# EAGLE design nano relay (EAGLE 9.6.2)
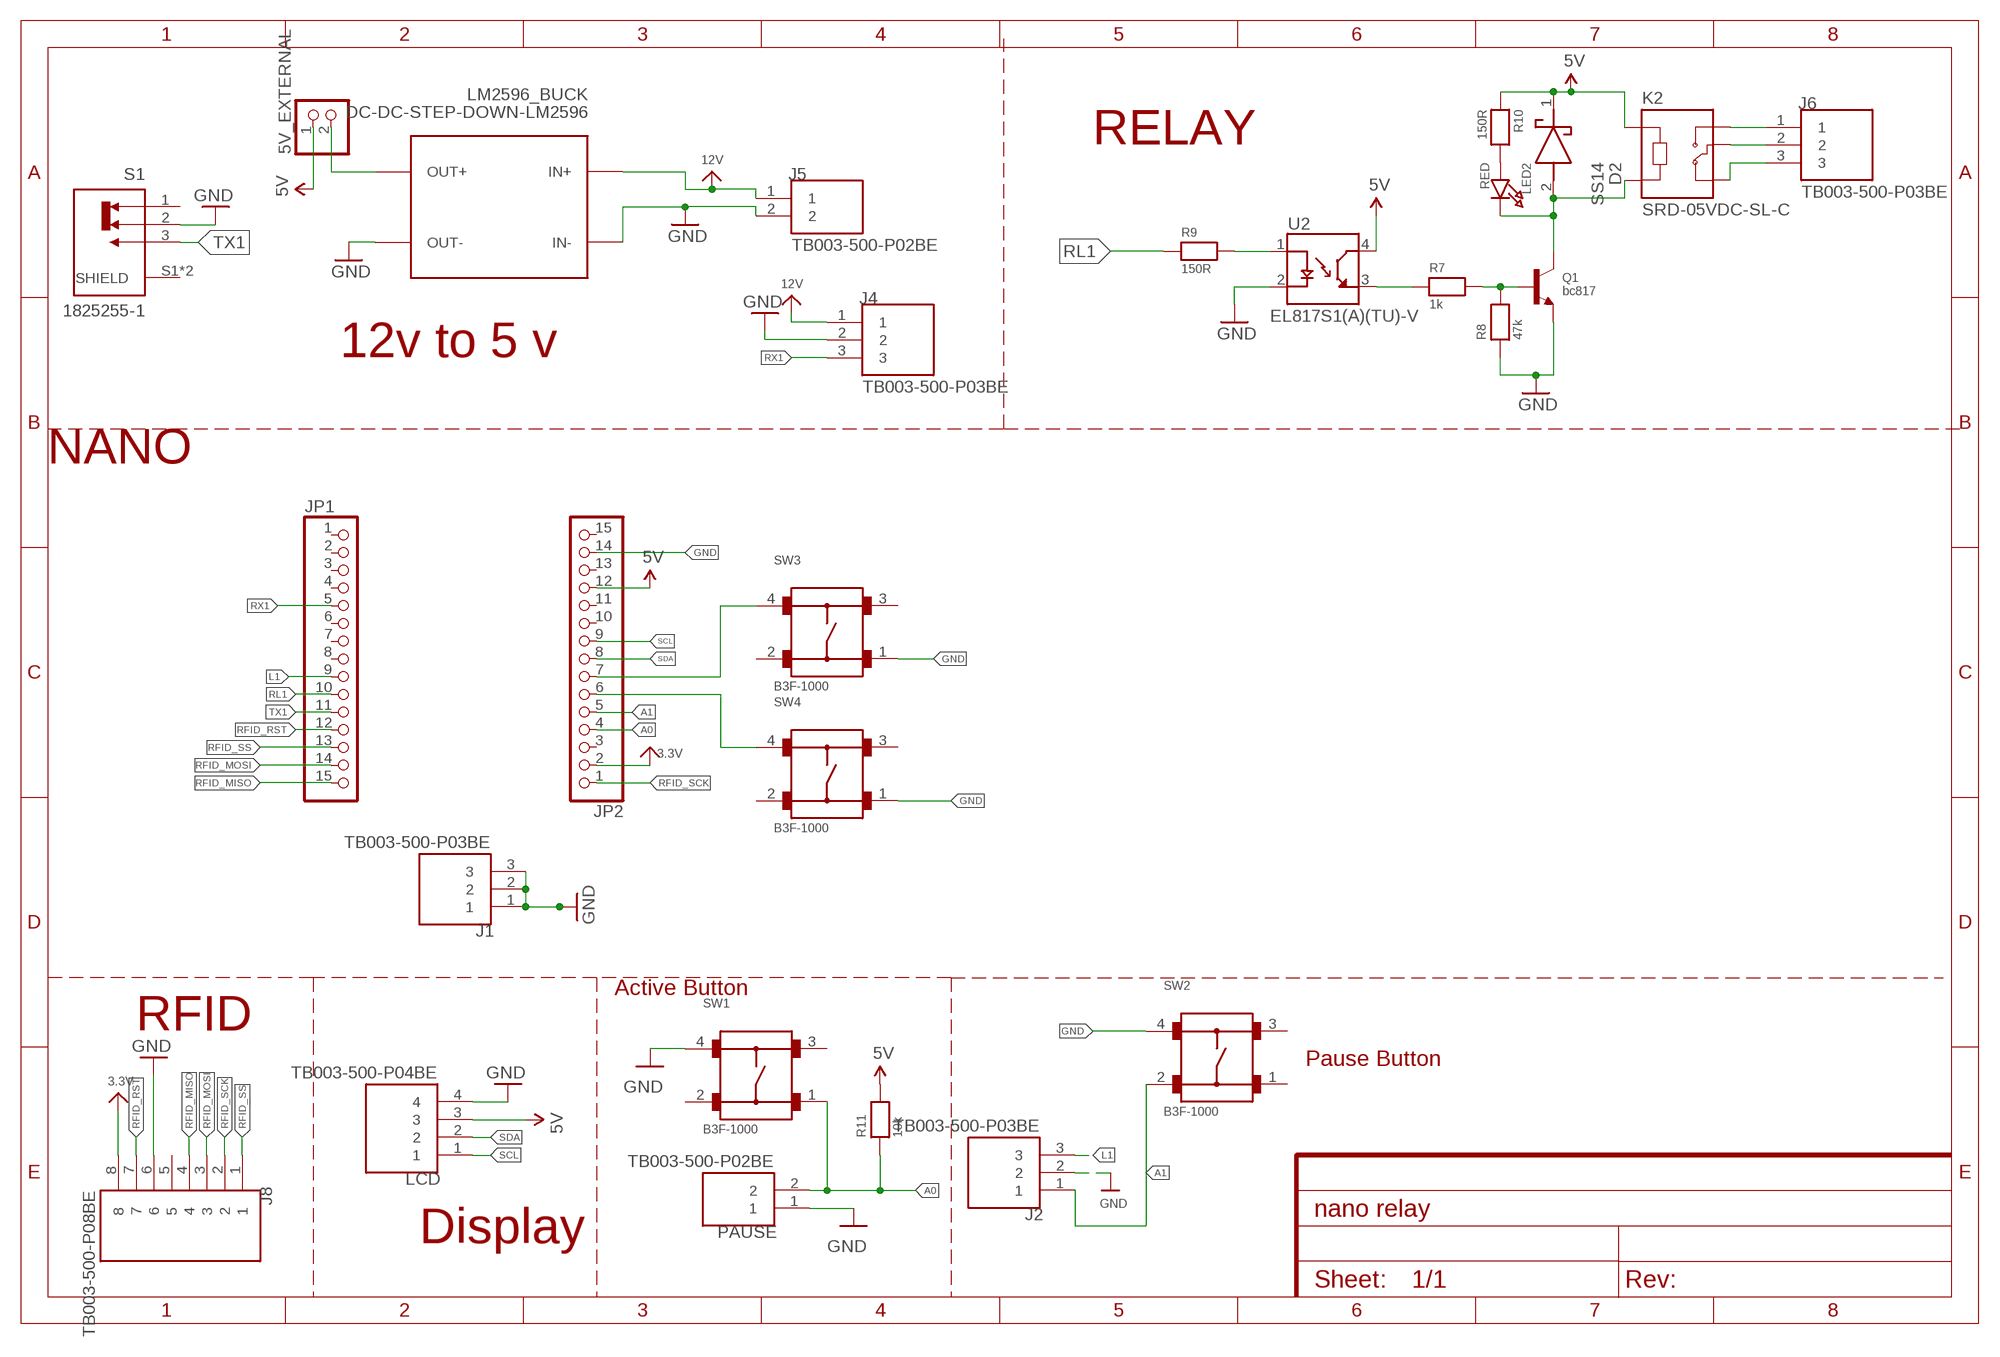
[diagram p0: schematic, sheet 1]

## Parts
5V_EXTERNAL  HEADER-1X2ROUND  [1X02_ROUND]
D2  SS14  [DIOM5227X270N]
J1  TB003-500-P03BE  [CUI_TB003-500-P03BE]
J2  TB003-500-P03BE  [CUI_TB003-500-P03BE]
J4  TB003-500-P03BE  [CUI_TB003-500-P03BE]
J5  TB003-500-P02BE  [CUI_TB003-500-P02BE]
J6  TB003-500-P03BE  [CUI_TB003-500-P03BE]
J8  TB003-500-P08BE  [CUI_TB003-500-P08BE]
JP1  HEADER-1X15  [1X15_ROUND_70]
JP2  HEADER-1X15  [1X15_ROUND_70]
K2  SRD-05VDC-SL-C  [RELAY_SRD-05VDC-SL-C]
LCD  TB003-500-P04BE  [CUI_TB003-500-P04BE]
LED2  RED  LED0603  [CHIPLED_0603]
LM2596_BUCK  DC-DC-STEP-DOWN-LM2596  [DC-DC-STEP-DOWN-LM2596]
PAUSE  TB003-500-P02BE  [CUI_TB003-500-P02BE]
Q1  bc817  TRANSISTOR_NPN  [SOT23-R]
R7  1k  RESISTOR0603  [0603]
R8  47k  RESISTOR0603  [0603]
R9  150R  RESISTOR0603  [0603]
R10  150R  RESISTOR0402  [0402]
R11  10k  RESISTOR0603  [0603]
S1  1825255-1  [SW_1825255-1]
SW1  B3F-1000  [B3F-1000]
SW2  B3F-1000  [B3F-1000]
SW3  B3F-1000  [B3F-1000]
SW4  B3F-1000  [B3F-1000]
U2  EL817S1(A)(TU)-V  [SOIC254P1030X390-4N_EL817S1(A)(TU)-V]

## Nets
3.3V: J8.8 JP2.2
5V: 5V_EXTERNAL.1 D2.1(K) JP2.12 K2.A1 LCD.3 R10.1 R11.2 U2.4(CT)
12V: J4.1 J5.1 LM2596_BUCK.IN+
A0: JP2.4 PAUSE.2 R11.1 SW1.1
A1: J2.1 JP2.5 SW2.2
GND: J1.1 J1.2 J1.3 J2.2 J4.2 J5.2 J8.6 JP2.14 LCD.4 LM2596_BUCK.IN- LM2596_BUCK.OUT- PAUSE.1 Q1.2(E) R8.1 S1.2 SW1.4 SW2.4 SW3.1 SW4.1 U2.2(C)
L1: J2.3 JP1.9
N$1: JP2.7 SW3.4
N$2: J6.1 K2.NO
N$3: LED2.A R10.2
N$4: JP2.6 SW4.4
N$5: J6.2 K2.COM
N$11: D2.2(A) K2.A2 LED2.C Q1.3(C)
N$12: Q1.1(B) R7.2 R8.2
N$13: J6.3 K2.NC
N$14: R7.1 U2.3(ET)
N$15: 5V_EXTERNAL.2 LM2596_BUCK.OUT+
N$16: R9.2 U2.1(A)
RFID_MISO: J8.4 JP1.15
RFID_MOSI: J8.3 JP1.14
RFID_RST: J8.7 JP1.12
RFID_SCK: J8.2 JP2.1
RFID_SS: J8.1 JP1.13
RL1: JP1.10 R9.1
RX1: J4.3 JP1.5
SCL: JP2.9 LCD.1
SDA: JP2.8 LCD.2
TX1: JP1.11 S1.3
Unconnected: J8.5 JP1.1 JP1.2 JP1.3 JP1.4 JP1.6 JP1.7 JP1.8 JP2.3 JP2.10 JP2.11 JP2.13 JP2.15 S1.1 S1.S1(SHIELD) S1.S2(SHIELD) SW1.2 SW1.3 SW2.1 SW2.3 SW3.2 SW3.3 SW4.2 SW4.3

## Notes on the sheet
- RELAY
- 12v to 5 v
- NANO
- Active Button
- RFID
- Pause Button
- Display

## Library data of the parts
5V_EXTERNAL = microbuilder:HEADER-1X2: PIN HEADER
D2 = SS14:SS14: 1.0 A Schottky Barrier Rectifiers Source: Datasheet <http://www.onsemi.com/pub/Collateral/SS19-D.pdf>; DESCRIPTION: 1.0 A Schottky Barrier Rectifiers; HEIGHT: 2.7mm; MANUFACTURER_NAME: ON Semiconductor; MANUFACTURER_PART_NUMBER: SS14; MOUSER_PART_NUMBER: 512-SS14; MOUSER_PRICE-STOCK: https://www.mouser.com/Search/Refine.aspx?Keyword=512-SS14; RS_PART_NUMBER: 7390467P; RS_PRICE-STOCK: http://uk.rs-online.com/web/p/products/7390467P
J1 J2 J4 J6 = TB003-500-P03BE:TB003-500-P03BE: Check prices <https://pricing.snapeda.com/parts/TB003-500-P03BE/CUI%20Devices/view-part?ref=eda>; AVAILABILITY: Good; CUI_PURCHASE_URL: https://www.cuidevices.com/product/interconnect/connectors/terminal-blocks/tb003-500-series?utm_source=snapeda.com&utm_medium=referral&utm_campaign=snapedaBOM; DESCRIPTION: 2~24 Poles, Screw Type, Horizontal, 5.0 Pitch, 26~14 (AWG), Terminal Block Connector; MF: CUI Devices; MP: TB003-500-P03BE; PACKAGE: None; PRICE: None; PURCHASE-URL: https://pricing.snapeda.com/search/part/TB003-500-P03BE/?ref=eda
J5 PAUSE = TB003-500-P02BE:TB003-500-P02BE: Check prices <https://pricing.snapeda.com/parts/TB003-500-P02BE/CUI%20Devices/view-part?ref=eda>; AVAILABILITY: Good; CUI_PURCHASE_URL: https://www.cuidevices.com/product/interconnect/connectors/terminal-blocks/tb003-500-series?utm_source=snapeda.com&utm_medium=referral&utm_campaign=snapedaBOM; DESCRIPTION: 2~24 Poles, Screw Type, Horizontal, 5.0 Pitch, 26~14 (AWG), Terminal Block Connector; MF: CUI Devices; MP: TB003-500-P02BE; PACKAGE: None; PRICE: None; PURCHASE-URL: https://pricing.snapeda.com/search/part/TB003-500-P02BE/?ref=eda
J8 = TB003-500-P08BE:TB003-500-P08BE: Check prices <https://pricing.snapeda.com/parts/TB003-500-P08BE/CUI%20Devices/view-part?ref=eda>; AVAILABILITY: Good; CUI_PURCHASE_URL: https://www.cuidevices.com/product/interconnect/connectors/terminal-blocks/tb003-500-series?utm_source=snapeda.com&utm_medium=referral&utm_campaign=snapedaBOM; DESCRIPTION: 2~24 Poles, Screw Type, Horizontal, 5.0 Pitch, 26~14 (AWG), Terminal Block Connector; MF: CUI Devices; MP: TB003-500-P08BE; PACKAGE: None; PRICE: None; PURCHASE-URL: https://pricing.snapeda.com/search/part/TB003-500-P08BE/?ref=eda
JP1 JP2 = microbuilder:HEADER-1X15: 1x15 Header
K2 = SRD-05VDC-SL-C:SRD-05VDC-SL-C: 5V Trigger Relay Module For Arduino And Raspberry Pi 5V Trigger Relay Module For Arduino And Raspberry Pi; AVAILABILITY: Unavailable; DESCRIPTION: 5V Trigger Relay Module For Arduino And Raspberry Pi 5V Trigger Relay Module For Arduino And Raspberry Pi; MF: Songle Relay; MP: SRD-05VDC-SL-C; PACKAGE: None; PRICE: None
LCD = TB003-500-P04BE:TB003-500-P04BE: Check prices <https://pricing.snapeda.com/parts/TB003-500-P04BE/CUI%20Devices/view-part?ref=eda>; AVAILABILITY: Good; CUI_PURCHASE_URL: https://www.cuidevices.com/product/interconnect/connectors/terminal-blocks/tb003-500-series?utm_source=snapeda.com&utm_medium=referral&utm_campaign=snapedaBOM; DESCRIPTION: 2~24 Poles, Screw Type, Horizontal, 5.0 Pitch, 26~14 (AWG), Terminal Block Connector; MF: CUI Devices; MP: TB003-500-P04BE; PACKAGE: None; PRICE: None; PURCHASE-URL: https://pricing.snapeda.com/search/part/TB003-500-P04BE/?ref=eda
LED2 = microbuilder:LED: LED 0603 - 0603 Surface Mount Package 2mA: Green LED - Low Power (3.9mcd, 2ma, 1.7Vf) - Digikey: 475-2709-2-ND Orange LED - Low Power (9.8mcd, 2ma, 1.8Vf) - Digikey: 475-1194-2-ND Red LED - Low Power (5mcd, 2ma, 1.8Vf) - Digikey: 475-1195-2-ND Yellow LED - Low Power (7mcd, 2ma, 1.8Vf) - Digikey: 475-1196-2-ND 5mA: Blue LED - Low Power (17mcd, 5ma, 2.9Vf) - Digikey: LNJ937W8CRACT-ND 0805 - 0805 Surface Mount Package 2mA: Red LED (8.8mcd, 2mA, 1.8Vf, Clear) - Low Power [Digikey: 475-2510-1-ND] Green LED (5mcd, 2mA, 1.8Vf, Clear) - Low Power [Digikey: 475-2730-1-ND] Yellow LED (11.3mcd, 2mA, 1.8Vf, Clear) - Low Power [Digikey: 475-2555-1-ND] 20mA: Red LED (104mcd, 20mA, Diffused) - LS R976 [Digikey: 475-1278-6-ND] Red LED (12mcd, 20mA, 2.0Vf, Clear) - APT2012EC [Digikey: 754-1128-1-ND] Green LED (15mcd, 20mA, 2.2Vf, Clear) - APT2012GC [Digikey: 754-1131-1-ND] Orange LED (160mcd, 20mA, 2.1Vf, Clear) - APT2012SECK [Digikey: 754-1130-1-ND] 1206 - 1206 Surface Mount Package Green LED (26mcd, 20mA, Diffused) - LG N971 [Digikey: 475-1407-6-ND] Red LED (15mcd, 20mA, Diffused) - LH N974 [Digikey: 475-1416-6-ND]
LM2596_BUCK = diy-modules:DC-DC-STEP-DOWN-LM2596: DC/DC Step-Down Regulator based on LM2596-ADJ chip LM2596 datasheet available here: http://www.ti.com/lit/ds/symlink/lm2596.pdf Click here to find device on ebay.com <http://www.ebay.com/sch/lm2596+power+regulator>
Q1 = microbuilder:TRANSISTOR_NPN: NPN Transistor Transistor (NPN) 500mA 45V - BC817 [Digikey: 568-1631-1-ND] Transistor (NPN) 500mA 45V - BC817,215 [Mouser: 771-BC817-T/R] SOT23-R - SOT23 footprint optimised for use with solder paste and reflow ovens. SOT23-W - SOT23 footprint optimised for hand-soldering (larger pads).
R7-R11 = microbuilder:RESISTOR: Resistors 0402 - 0402 Surface Mount Package 22 Ohm 1% 1/16W [Digikey: 311-22.0LRTR-ND] 33 Ohm 5% 1/16W 1.0K 5% 1/16W 1.5K 5% 1/16W 2.0K 1% 1/16W 10.0K 1% 1/16W [Digikey: 311-10.0KLRTR-ND] 10.0K 5% 1/16W [Digikey: RMCF0402JT10K0TR-ND] 12.1K 1% 1/16W [Digikey: 311-22.0LRTR-ND] 100.0K 5% 1/16W 0603 - 0603 Surface Mount Package 0 Ohm 1/10 Watt 1% Resistor 15 Ohm 1/10 Watt 1% Resistor 33 Ohm 1/10 Watt 1% Resistor 49.9 Ohm 1/10 Watt 1% Resistor 100 Ohm 1/10 Watt 1% Resistor 150 Ohm 1/10 Watt 1% Resistor 240 Ohm 1/10 Watt 1% Resistor 390 Ohm 1/10 Watt 1% Resistor 560 Ohm 1/10 Watt 1% Resistor 680 Ohm 1/10 Watt 1% Resistor 750 Ohm 1/10 Watt 1% Resistor 1.0K Ohm 1/10 Watt 1% Resistor 1.5K Ohm 1/10 Watt 1% Resistor 2.0K Ohm 1/10 Watt 1% Resistor 2.2K Ohm 1/10 Watt 1% Resistor 3.3K Ohm 1/10 Watt 1% Resistor 4.7K Ohm 1/10 Watt 1% Resistor 10.0K Ohm 1/10 Watt 1% Resistor 12.0K Ohm 1/10 Watt 1% Resistor 12.1K Ohm 1/10 Watt 1% Resistor 20.0K Ohm 1/10 Watt 1% Resistor 33.0K Ohm 1/10 Watt 1% Resistor 100.0K Ohm 1/10 Watt 1% Resistor 0805 - 0805 Surface Mount Package 0 Ohm 1/8 Watt 1% Resistor 33 Ohm 1/8 Watt 1% Resistor 100 Ohm 1/8 Watt 1% Resistor 150 Ohm 1/8 Watt 1% Resistor 200 Ohm 1/8 Watt 1% Resistor 240 Ohm 1/8 Watt 1% Resistor 330 Ohm 1/8 Watt 1% Resistor 390 Ohm 1/8 Watt 1% Resistor 470 Ohm 1/8 Watt 1% Resistor 1.0K Ohm 1/8 Watt 1% Resistor 1.5K Ohm 1/8 Watt 1% Resistor 2.0K Ohm 1/8 Watt 1% Resistor 4.7K Ohm 1/8 Watt 1% Resistor 5.1K Ohm 1/8 Watt 1% Resistor 5.6K Ohm 1/8 Watt 1% Resistor 10.0K Ohm 1/8 Watt 1% Resistor 22.0K Ohm 1/8 Watt 1% Resistor 33.0K Ohm 1/8 Watt 1% Resistor 100K Ohm 1/8 Watt 1% Resistor 1206 - 1206 Surface Mount Package 2012 - 2010 Surface Mount Package 0.11 Ohm 1/2 Watt 1% Resistor - Digikey: RHM.11UCT-ND
S1 = 1825255-1:1825255-1: Switch Slide ON None ON SPDT Top Slide 0.3A 125VAC PC Pins Thru-Hole Tray; COMMENT: 1825255-1; DESCRIPTION: Switch Slide ON None ON SPDT Top Slide 0.3A 125VAC PC Pins Thru-Hole Tray; DIGI-KEY_PART_NUMBER: 450-1567-ND; MF: TE Connectivity; MP: 1825255-1; PACKAGE: Custom Package TE Connectivity; PURCHASE-URL: https://pricing.snapeda.com/search/part/1825255-1/?ref=eda
SW1-SW4 = Switch:B3F-1000: Tactile Switch SPST-NO Top Actuated Through Hole Manufacturer's datasheet <https://omronfs.omron.com/en_US/ecb/products/pdf/en-b3f.pdf>; CREATED_BY: PCBLayout.com; DIGI_KEY_PART_NUMBER: SW400-ND; MANUFACTURER: Omron Electronics Inc-EMC Div; MPN: B3F-1000; PACKAGE: SPST-NO
U2 = EL817S1_A__TU_-V:EL817S1(A)(TU)-V: Optoisoltr 5kv Transistor 4-Smd; DESCRIPTION: Optoisolator Transistor Output 5000Vrms 1 Channel 4-SMD; DIGI-KEY_PART_NUMBER: EL817S1(A)(TU)-V-ND; MF: Everlight Electronics; MP: EL817S1(A)(TU)-V; PACKAGE: SMD-4 Everlight Electronics Co Ltd

## Net classes
0 default: width 0.203 mm, drill 0.406 mm, clearance 0.203 mm

## Board
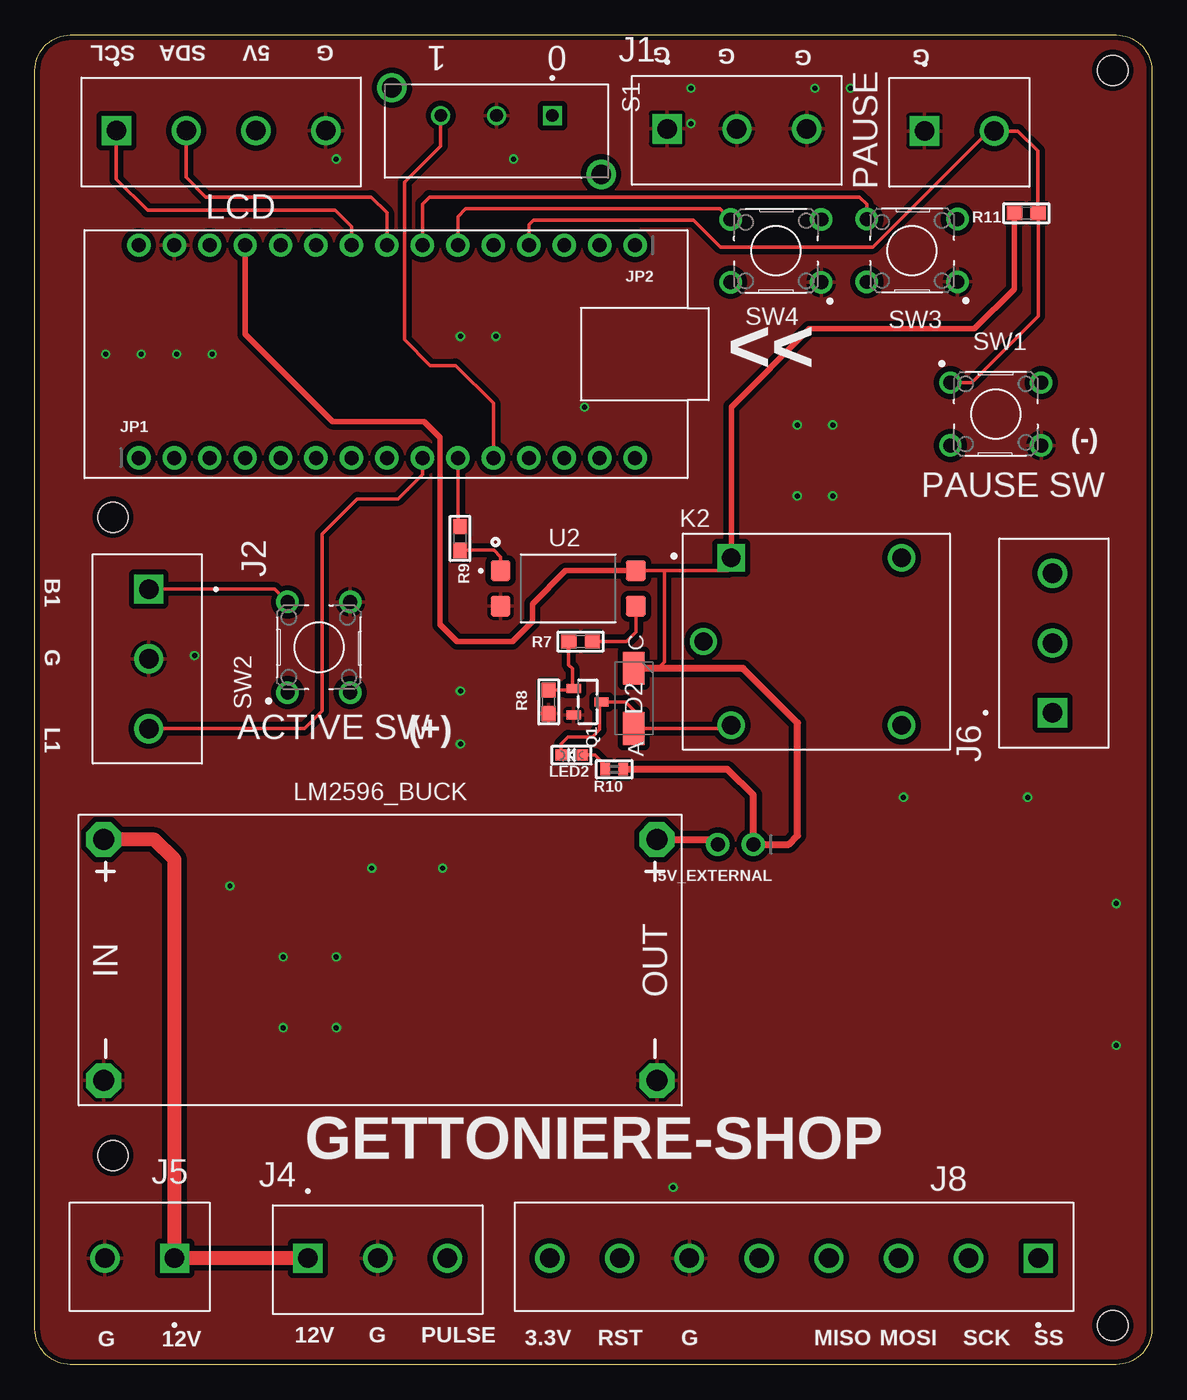
[diagram p1: board, top side]
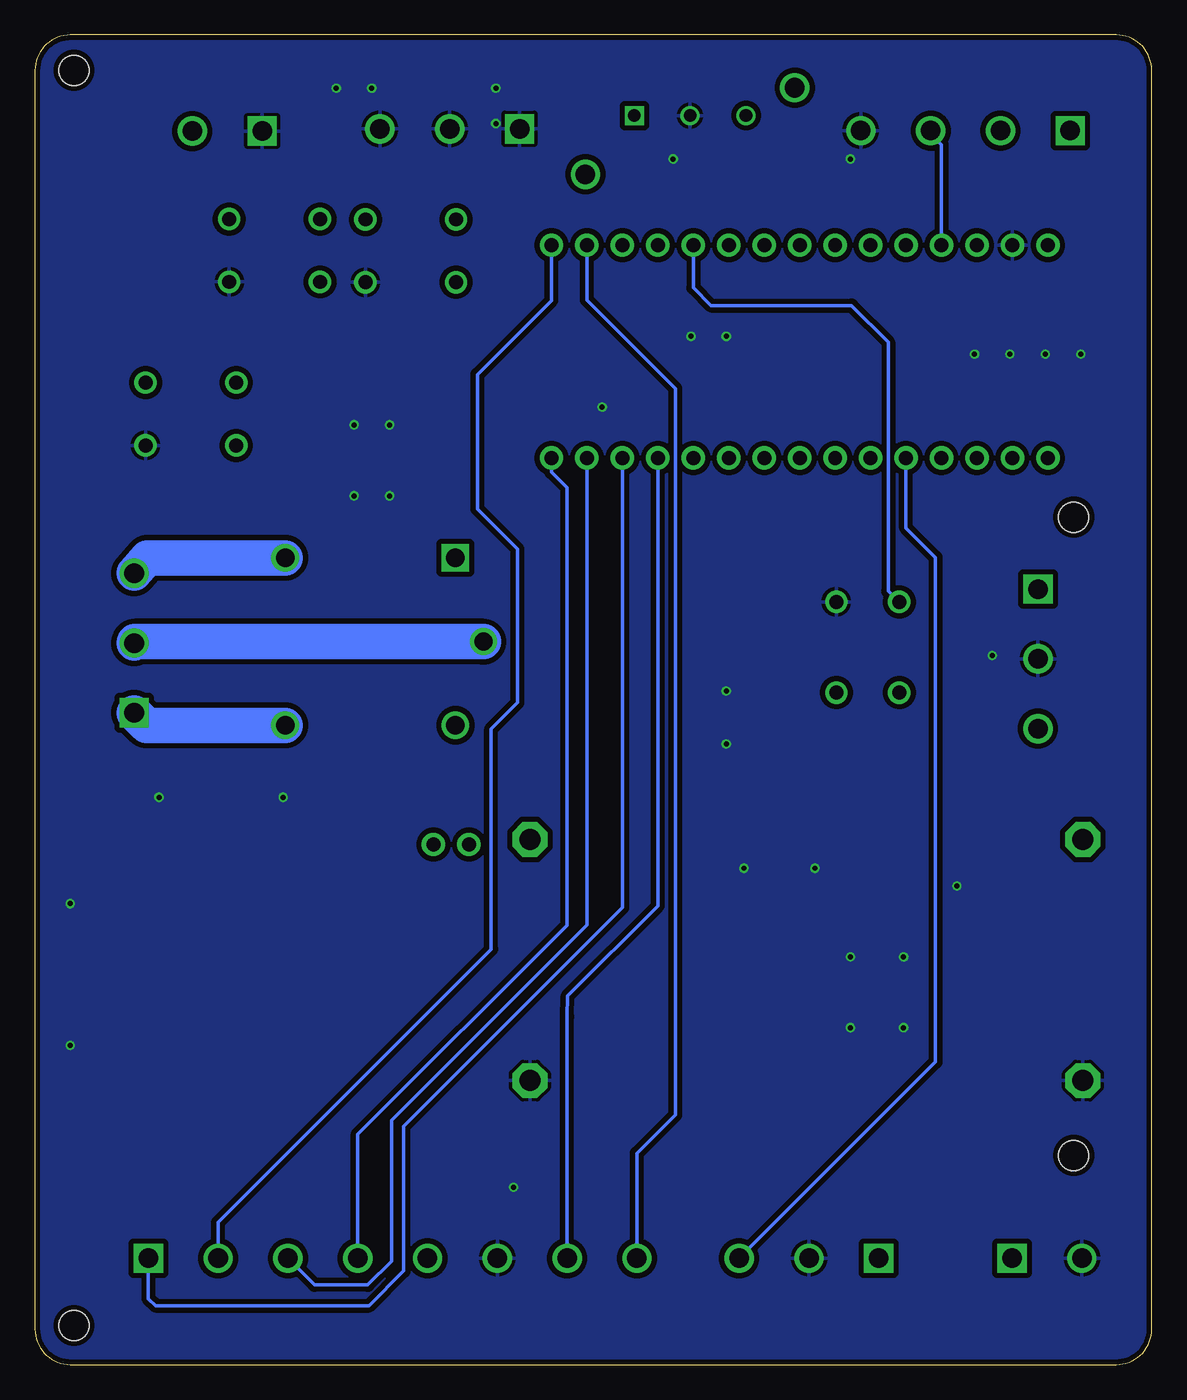
[diagram p2: board, bottom side, seen from below]

Size 80.01 x 95.25 mm. Coordinates in mm from the lower left corner, seen from the top.
Outline: 80.01,92.71 80.01,2.54 arc-90 77.47,0 2.54,0 arc-90 0,2.54 0,92.71 arc-90 2.54,95.25 77.47,95.25 arc-90 80.01,92.71
Copper layers (1*16): Top 0.035mm / dielectric 1.5mm / Bottom 0.035mm
Design rules "default *": minimum track width 8mil, minimum drill 0.3mm, track to track 6mil, track to pad 6mil, pad to pad 6mil, via to via 6mil, smd to smd 0mil, copper to edge 10mil, drill to drill 6mil, minimum pad ring 8mil, minimum via ring 6mil, stop-mask expansion 2mil, vias tented up to drill 15mil, thermal gap 10mil
Holes 2.16 mm at 77.22,2.79 77.22,92.71 5.59,14.99 5.59,60.71

### Footprints (pad centres in the part's own frame; a part is rotated, then mirrored left to right if it is on the bottom)
1X02_ROUND = drill 1 pad 1.676: 1 -1.27,0; 2 1.27,0
DIOM5227X270N = smd 2.35 x 1.55: 1 -2.15,0; 2 2.15,0
CUI_TB003-500-P03BE = drill 1.4 square: 1 0,0 | drill 1.4: 2 5,0; 3 10,0
CUI_TB003-500-P02BE = drill 1.4 square: 1 0,0 | drill 1.4: 2 5,0
CUI_TB003-500-P08BE = drill 1.4 square: 1 0,0 | drill 1.4: 2 5,0; 3 10,0; 4 15,0; 5 20,0; 6 25,0; 7 30,0; 8 35,0
1X15_ROUND_70 = drill 1 pad 1.676: 1 -17.78,0; 2 -15.24,0; 3 -12.7,0; 4 -10.16,0; 5 -7.62,0; 6 -5.08,0; 7 -2.54,0; 8 0,0; 9 2.54,0; 10 5.08,0; 11 7.62,0; 12 10.16,0; 13 12.7,0; 14 15.24,0; 15 17.78,0
RELAY_SRD-05VDC-SL-C = drill 1.32 square: A1 -6.1,6 | drill 1.32: A2 -6.1,-6; NC 6.1,6; NO 6.1,-6 | drill 1.29: COM -8.1,0
CUI_TB003-500-P04BE = drill 1.4 square: 1 0,0 | drill 1.4: 2 5,0; 3 10,0; 4 15,0
CHIPLED_0603 = smd 0.8 x 0.8: A 0,-0.75; C 0,0.75
DC-DC-STEP-DOWN-LM2596 = drill 1.5 pad 2.5 octagon: IN+ -19.812,8.636; IN- -19.812,-8.636; OUT+ 19.812,8.636; OUT- 19.812,-8.636
SOT23-R = smd 0.635 x 1.016: 1 -0.95,-1; 2 0.95,-1; 3 0,1
0603 = smd 1.1 x 1: 1 -0.85,0; 2 0.85,0
0402 = smd 0.7 x 0.9: 1 -0.65,0; 2 0.65,0
SW_1825255-1 = drill 0.902 square: 1 -1.1,4 | drill 0.902: 2 -1.1,0; 3 -1.1,-4 | drill 1.402: S1 3.1,7.5; S2 -3.1,-7.5
B3F-1000 = drill 1 pad 1.6: 1 -3.25,2.25; 2 3.25,2.25; 3 -3.25,-2.25; 4 3.25,-2.25
SOIC254P1030X390-4N_EL817S1(A)(TU)-V = smd 1.41 x 1.47: 1 -4.85,1.27; 2 -4.85,-1.27; 3 4.85,-1.27; 4 4.85,1.27

### Placement (x,y rotation side)
5V_EXTERNAL  50.19,37.26 180 top
D2  42.9,47.73 270 top
J1  45.29,88.52 0 top
J2  8.15,55.55 270 top
J4  19.56,7.62 0 top
J5  10.01,7.62 180 top
J6  72.9,46.69 90 top
J8  71.88,7.62 180 top
JP1  25.22,64.95 0 top
JP2  25.22,80.19 180 top
K2  55.98,51.79 0 top
LCD  5.84,88.39 0 top
LED2  38.46,43.66 90 top
LM2596_BUCK  24.74,28.98 0 top
PAUSE  63.73,88.37 0 top
Q1  39.6,47.47 270 top
R7  39.09,51.79 180 top
R8  36.8,47.47 90 top
R9  30.45,59.18 270 top
R10  41.5,42.65 180 top
R11  71.02,82.47 180 top
S1  33.07,88.37 270 top
SW1  68.83,68.1 0 top
SW2  20.35,51.38 90 top
SW3  62.84,79.81 180 top
SW4  53.09,79.78 180 top
U2  38.2,55.6 0 top

### Tracks (layer width: path | path; a pad name or v marks a point on that pad's centre or on a via)
3.3V
  Bottom 0.254: J8.8 36.88,15.14 34.14,17.88 34.14,69.93 40.46,76.25 JP2.2
5V
  Top 0.254: U2.4 45.09,56.87 | 45.09,56.87 49.66,56.87 49.88,57.09 K2.A1 | D2.1 43.33,49.88 44.62,49.88 45.09,50.34 45.09,56.87
  Top 0.381: K2.A1 49.88,68.6 55.47,74.19 67.31,74.19 70.17,77.05 R11.2 70.17,82.53 | JP2.12 15.06,73.81 21.31,67.56 27.86,67.56 29.03,66.4 29.03,53.01 30.25,51.79 34.21,51.79 35.64,53.21 35.64,54.48 38.02,56.87 U2.4
  Top 0.508: R10.1 49.61,42.65 51.46,40.79 5V_EXTERNAL.1 54,37.26 54.63,37.9 54.63,45.97 50.73,49.88 43.33,49.88
  Bottom 0.254: LCD.3 15.84,88.19 15.85,88.19 15.06,87.4 JP2.12
12V
  Top 1.016: J4.1 J5.1 10.01,36.17 8.56,37.62 LM2596_BUCK.IN+
A0
  Top 0.254: SW1.1 67.11,70.35 71.87,75.11 R11.1 71.85,82.49 71.85,86.94 70.43,88.37 PAUSE.2 68.33,88.37 60.02,80.06 49.12,80.06 47.19,81.99 35.71,81.99 35.38,81.66 JP2.4
A1
  Top 0.254: J2.1 17.18,55.55 SW2.2
  Bottom 0.254: JP2.5 32.84,77.14 31.57,75.87 21.51,75.87 18.87,73.23 18.87,55.41 SW2.2
GND  (via drill 0.36)
  other vias: 5.08,72.39 7.62,72.39 10.16,72.39 12.7,72.39 30.48,73.66 33.02,73.66 54.61,67.31 57.15,67.31 46.99,91.44 46.99,88.9 39.37,68.58 30.48,44.45 30.48,48.26 54.61,62.23 57.15,62.23 17.78,24.13 21.59,24.13 24.13,35.56 29.21,35.56 62.23,40.64 71.12,40.64 77.47,33.02 77.47,22.86 45.72,12.7 17.78,29.21 21.59,29.21 13.97,34.29 11.43,50.8 21.59,86.36 34.29,86.36 58.42,91.44 55.88,91.44
  pour Top (isolate 0.381): 0,95.25 80.01,95.25 80.01,0 0,0
  pour Bottom (isolate 0.381): 0,95.25 80.01,95.25 80.01,0 0,0
L1
  Top 0.254: J2.3 19.31,45.55 20.57,46.81 20.57,59.49 23.09,62 26.01,62 27.76,63.75 JP1.9
N$1
  Top 0.254: JP2.7 27.76,83.13 28.27,83.64 59.08,83.64 59.59,83.13 SW3.4
N$2
  Bottom 2.54: K2.NO 72,45.79 J6.1
N$3
  Top 0.254: LED2.A 40.13,43.66 40.85,42.94 R10.2
N$4
  Top 0.254: JP2.6 30.3,82.25 30.86,82.8 49.06,82.8 SW4.4
N$5
  Bottom 2.54: K2.COM 72.87,51.79 J6.2
N$11
  Top 0.254: D2.2 42.95,45.58 | 42.95,45.58 49.67,45.58 K2.A2 | Q1.3 40.62,47.47 | 40.62,47.47 42.29,47.47 42.95,46.81 42.95,45.58 | LED2.C 37.71,44.46 38.2,44.96 39.93,44.96 40.46,45.49 40.46,47.32 40.62,47.47
N$12
  Top 0.254: R8.2 38.5,48.32 | 38.5,48.32 Q1.1 | R7.2 38.24,50.13 38.5,49.87 38.5,48.32
N$13
  Bottom 2.54: K2.NC 71.95,57.79 J6.3
N$14
  Top 0.254: U2.3 43.05,52.48 42.37,51.79 R7.1
N$15
  Top 0.508: LM2596_BUCK.OUT+ 48.56,37.62 5V_EXTERNAL.2
N$16
  Top 0.254: R9.2 32.88,58.33 33.35,57.86 U2.1
RFID_MISO
  Bottom 0.254: J8.4 56.88,16.5 41.91,31.48 41.91,62.83 43,63.93 JP1.15
RFID_MOSI
  Bottom 0.254: JP1.14 40.46,31.5 54.46,17.5 54.46,7.42 56.16,5.71 59.98,5.71 J8.3
RFID_RST
  Bottom 0.254: J8.7 41.88,24.92 41.84,26.41 35.38,32.87 JP1.12
RFID_SCK
  Bottom 0.254: J8.2 66.88,10.18 47.32,29.74 47.32,45.54 45.44,47.42 45.44,58.42 48.31,61.29 48.31,70.92 43,76.22 JP2.1
RFID_SS
  Bottom 0.254: J8.1 71.88,4.72 71.37,4.22 56.08,4.22 53.59,6.71 53.59,17.07 37.92,32.74 JP1.13
RL1
  Top 0.254: JP1.10 30.3,60.18 R9.1
RX1
  Bottom 0.254: J4.3 15.53,21.65 15.49,21.68 15.49,57.82 17.6,59.93 JP1.5
SCL
  Top 0.254: LCD.1 5.84,84.91 8.08,82.68 21.51,82.68 22.68,81.51 JP2.9
SDA
  Top 0.254: LCD.2 10.84,85.04 12.24,83.64 24.08,83.64 25.22,82.5 JP2.8
TX1
  Top 0.254: JP1.11 32.84,68.86 30.12,71.58 28.32,71.58 26.49,73.41 26.49,84.71 29.07,87.29 S1.3

### Text on the board
tPlace: << | (-) | C | (+) | A
tNames: SCL | SDA | 5V | G | 1 | 0 | G | G | G | G | PAUSE SW | B1 | G | L1 | ACTIVE SW | GETTONIERE-SHOP | 12V | G | PULSE | G | 12V | 3.3V | RST | G | MISO | MOSI | SCK | SS